# Altium schematic sheet Main IF Board 7.SchDoc: Up Converter DDR and 1st IF
size A3; Author: L Lerner; Revision: 0
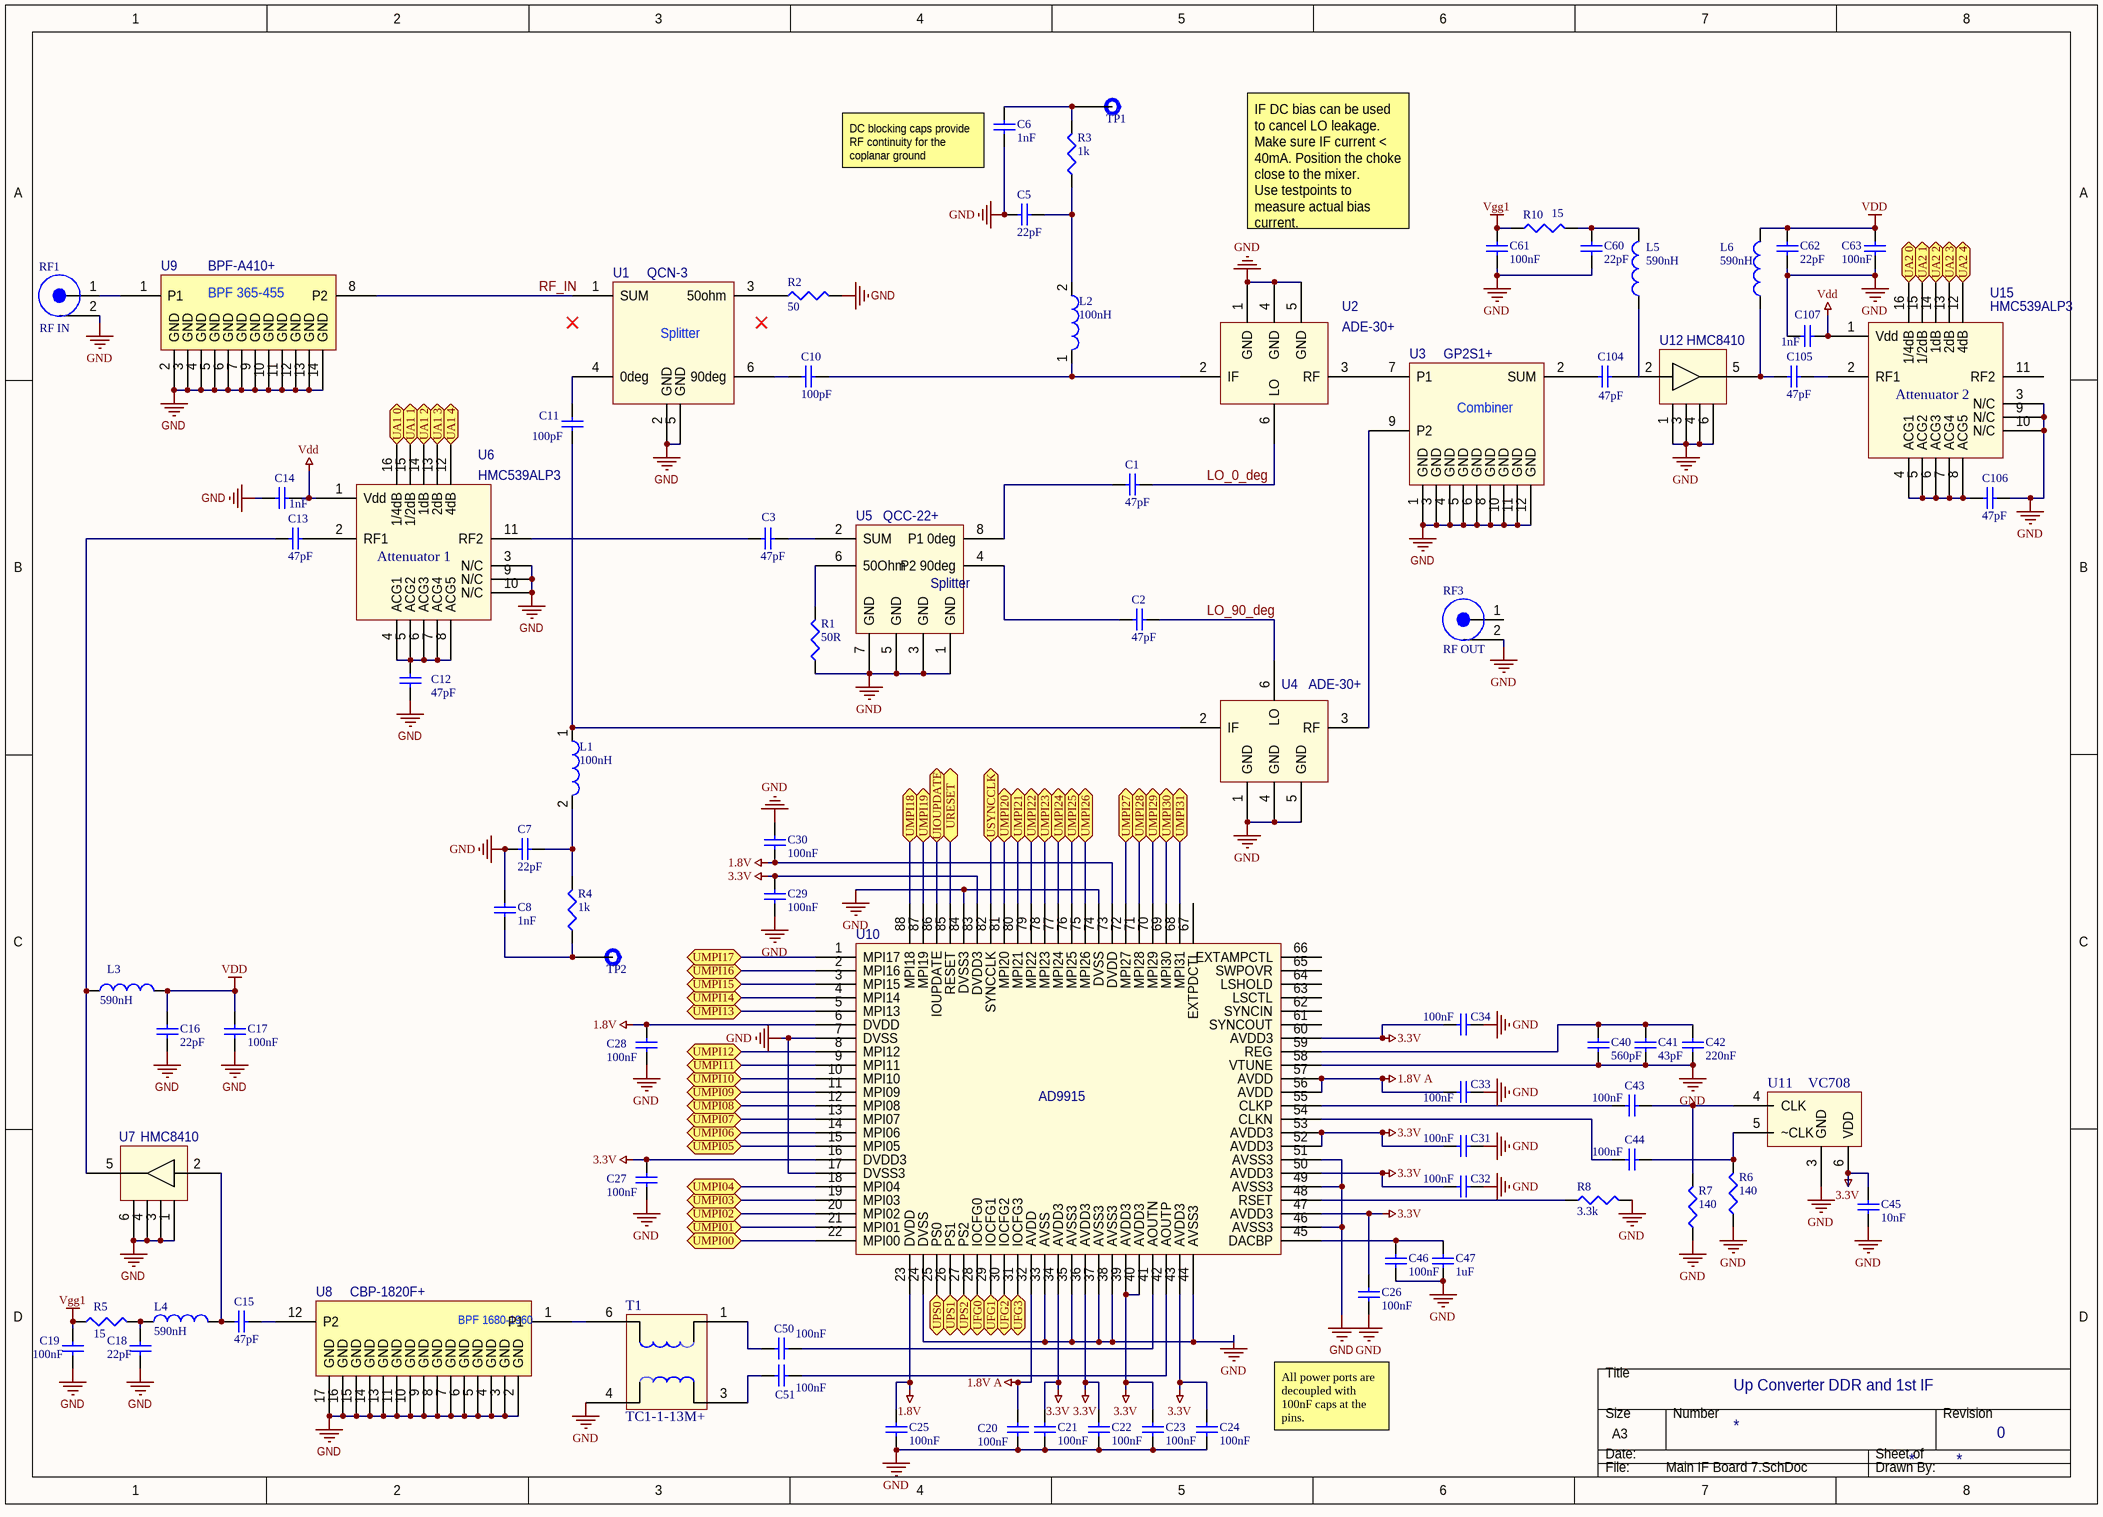
[diagram p0: Main IF Board 7.SchDoc]

## Parts
C1  value 47pF  [CAP0402]  (hidden comment: ATC520L103KT16T)
C2  value 47pF  [CAP0402]  (hidden comment: ATC520L103KT16T)
C3  value 47pF  [CAP0402]  (hidden comment: ATC520L103KT16T)
C5  value 22pF  [CAP0402]  (hidden comment: Capacitor)
C6  value 1nF  [CAP0603]  (hidden comment: Capacitor)
C7  value 22pF  [CAP0402]  (hidden comment: Capacitor)
C8  value 1nF  [CAP0603]  (hidden comment: Capacitor)
C10  value 100pF  [CAP0402]  (hidden comment: Capacitor)
C11  value 100pF  [CAP0402]  (hidden comment: Capacitor)
C12  value 47pF  [CAP0402]  (hidden comment: Capacitor)
C13  value 47pF  [CAP0402]  (hidden comment: Capacitor)
C14  value 1nF  [CAP0402]  (hidden comment: Capacitor)
C15  value 47pF  [CAP0402]  (hidden comment: Capacitor)
C16  value 22pF  [CAP0402]  (hidden comment: Capacitor)
C17  value 100nF  [CAP0402]  (hidden comment: Capacitor)
C18  value 22pF  [CAP0402]  (hidden comment: Capacitor)
C19  value 100nF  [CAP0603]  (hidden comment: Capacitor)
C20  value 100nF  [CAP0402]  (hidden comment: Capacitor)
C21  value 100nF  [CAP0402]  (hidden comment: Capacitor)
C22  value 100nF  [CAP0402]  (hidden comment: Capacitor)
C23  value 100nF  [CAP0402]  (hidden comment: Capacitor)
C24  value 100nF  [CAP0402]  (hidden comment: Capacitor)
C25  value 100nF  [CAP0402]  (hidden comment: Capacitor)
C26  value 100nF  [CAP0402]  (hidden comment: Capacitor)
C27  value 100nF  [CAP0402]  (hidden comment: Capacitor)
C28  value 100nF  [CAP0402]  (hidden comment: Capacitor)
C29  value 100nF  [CAP0402]  (hidden comment: Capacitor)
C30  value 100nF  [CAP0402]  (hidden comment: Capacitor)
C31  value 100nF  [CAP0402]  (hidden comment: Capacitor)
C32  value 100nF  [CAP0402]  (hidden comment: Capacitor)
C33  value 100nF  [CAP0402]  (hidden comment: Capacitor)
C34  value 100nF  [CAP0402]  (hidden comment: Capacitor)
C40  value 560pF  [CAP0402]  (hidden comment: Capacitor)
C41  value 43pF  [CAP0402]  (hidden comment: Capacitor)
C42  value 220nF  [CAP0603]  (hidden comment: Capacitor)
C43  value 100nF  [CAP0402]  (hidden comment: Capacitor)
C44  value 100nF  [CAP0402]  (hidden comment: Capacitor)
C45  value 10nF  [CAP0402]  (hidden comment: Capacitor)
C46  value 100nF  [CAP0402]  (hidden comment: Capacitor)
C47  value 1uF  [CAP0603]  (hidden comment: Capacitor)
C50  value 100nF  [CAP0402]  (hidden comment: Capacitor)
C51  value 100nF  [CAP0402]  (hidden comment: Capacitor)
C60  value 22pF  [CAP0402]  (hidden comment: Capacitor)
C61  value 100nF  [CAP0402]  (hidden comment: Capacitor)
C62  value 22pF  [CAP0402]  (hidden comment: Capacitor)
C63  value 100nF  [CAP0402]  (hidden comment: Capacitor)
C104  value 47pF  [CAP0402]  (hidden comment: ATC520L103KT16T)
C105  value 47pF  [CAP0402]  (hidden comment: Capacitor)
C106  value 47pF  [CAP0402]  (hidden comment: Capacitor)
C107  value 1nF  [CAP0402]  (hidden comment: Capacitor)
L1  value 100nH  [Coilcraft_BCL-122]  (hidden comment: Inductor)
L2  value 100nH  [Coilcraft_BCL-122]  (hidden comment: Inductor)
L3  value 590nH  [CAP0402]  (hidden comment: Inductor)
L4  value 590nH  [CAP0402]  (hidden comment: Inductor)
L5  value 590nH  [CAP0402]  (hidden comment: Inductor)
L6  value 590nH  [TBD]  (hidden comment: Inductor)
R1  value 50R  [RES0603]  (hidden comment: Resistor)
R2  value 50  [RES0603]  (hidden comment: Resistor)
R3  value 1k  [RES0603]  (hidden comment: Resistor)
R4  value 1k  [RES0603]  (hidden comment: Resistor)
R5  value 15  [RES0402]  (hidden comment: Resistor)
R6  value 140  [RES0402]  (hidden comment: Resistor)
R7  value 140  [RES0402]  (hidden comment: Resistor)
R8  value 3.3k  [RES0402]  (hidden comment: Resistor)
R10  value 15  [RES0402]  (hidden comment: Resistor)
RF1  RF IN  [SMA_edge_launch_cutout_Cinch]
RF3  RF OUT  [SMA_edge_launch_cutout_Cinch]
T1  TC1-1-13M+
TP1  TP1  [1XHeader 100mil]  (value not drawn)
TP2  TP2  [1XHeader 100mil]  (value not drawn)
U1  QCN-3  [FV1206-1]
U2  ADE-30+  [Minicircuits_CD542]
U3  GP2S1+  [DQ1225]
U4  ADE-30+  [Minicircuits_CD542]
U5  QCC-22+  [Minicircuits_GF981]
U6  HMC539ALP3
U7  HMC8410
U8  CBP-1820F+  [CBP-1820F+]
U9  BPF-A410+  [BPF-A410+]
U10  AD9915  [AD9915]
U11  VC708  [VC708]
U12  HMC8410  [HMC8410]
U15  HMC539ALP3  [HMC539ALP3]

## Ports
UA1 0 (bidir), UA1 1 (bidir), UA1 2 (bidir), UA1 3 (bidir), UA1 4 (bidir), UA2 0 (bidir), UA2 1 (bidir), UA2 2 (bidir), UA2 3 (bidir), UA2 4 (bidir), UFG0 (bidir), UFG1 (bidir), UFG2 (bidir), UFG3 (bidir), UIOUPDATE (bidir), UMPI00 (bidir), UMPI01 (bidir), UMPI02 (bidir), UMPI03 (bidir), UMPI04 (bidir), UMPI05 (bidir), UMPI06 (bidir), UMPI07 (bidir), UMPI08 (bidir), UMPI09 (bidir), UMPI10 (bidir), UMPI11 (bidir), UMPI12 (bidir), UMPI13 (bidir), UMPI14 (bidir), UMPI15 (bidir), UMPI16 (bidir), UMPI17 (bidir), UMPI18 (bidir), UMPI19 (bidir), UMPI20 (bidir), UMPI21 (bidir), UMPI22 (bidir), UMPI23 (bidir), UMPI24 (bidir), UMPI25 (bidir), UMPI26 (bidir), UMPI27 (bidir), UMPI28 (bidir), UMPI29 (bidir), UMPI30 (bidir), UMPI31 (bidir), UPS0 (bidir), UPS1 (bidir), UPS2 (bidir), URESET (bidir), USYNCCLK (bidir)

## Nets
1.8V: C25.2 C28.2 C30.1 U10.6(DVDD) U10.23(DVDD) U10.73(DVDD)
1.8V A: C20.2 C33.1 U10.32(AVDD) U10.56(AVDD) U10.57(AVDD)
3.3V: C21.2 C22.2 C23.2 C24.2 C26.2 C27.1 C29.2 C31.1 C32.1 C34.1 C45.2 U10.16(DVDD3) U10.34(AVDD3) U10.36(AVDD3) U10.39(AVDD3) U10.40(AVDD3) U10.43(AVDD3) U10.47(AVDD3) U10.50(AVDD3) U10.52(AVDD3) U10.53(AVDD3) U10.60(AVDD3) U10.83(DVDD3) U11.6(VDD)
GND: C5.1 C6.2 C7.1 C8.2 C12.1 C14.1 C16.1 C17.1 C18.1 C19.1 C20.1 C21.1 C22.1 C23.1 C24.1 C25.1 C26.1 C27.2 C28.1 C29.1 C30.2 C31.2 C32.2 C33.2 C34.2 C40.1 C41.1 C42.1 C45.1 C46.1 C47.1 C60.1 C61.1 C62.1 C63.1 C106.2 C107.1 R1.1 R2.2 R6.1 R7.1 R8.2 RF1.2 RF3.2 T1.4 U1.2(GND) U1.5(GND) U2.1(GND) U2.4(GND) U2.5(GND) U3.1(GND) U3.3(GND) U3.4(GND) U3.5(GND) U3.6(GND) U3.8(GND) U3.10(GND) U3.11(GND) U3.12(GND) U4.1(GND) U4.4(GND) U4.5(GND) U5.1(GND) U5.3(GND) U5.5(GND) U5.7(GND) U6.3(N/C) U6.9(N/C) U6.10(N/C) U7.1 U7.3 U7.4 U7.6 U8.2(GND) U8.3(GND) U8.4(GND) U8.5(GND) U8.6(GND) U8.7(GND) U8.8(GND) U8.9(GND) U8.10(GND) U8.11(GND) U8.13(GND) U8.14(GND) U8.15(GND) U8.16(GND) U8.17(GND) U9.2(GND) U9.3(GND) U9.4(GND) U9.5(GND) U9.6(GND) U9.7(GND) U9.9(GND) U9.10(GND) U9.11(GND) U9.12(GND) U9.13(GND) U9.14(GND) U10.7(DVSS) U10.17(DVSS3) U10.24(DVSS) U10.33(AVSS) U10.35(AVSS3) U10.37(AVSS3) U10.38(AVSS3) U10.44(AVSS3) U10.46(AVSS3) U10.49(AVSS3) U10.51(AVSS3) U10.58(VTUNE) U10.74(DVSS) U10.84(DVSS3) U11.3(GND) U12.1 U12.3 U12.4 U12.6 U15.3(N/C) U15.9(N/C) U15.10(N/C)
VDD: C14.2 C16.2 C17.2 C62.2 C63.2 C107.2 L3.2 L6.2 U6.1(Vdd) U15.1(Vdd)
Vgg1: C19.2 C61.2 R5.1 R10.1
LO_0_deg: C1.1 U2.6(LO)
LO_90_deg: C2.2 U4.6(LO)
RF_IN: U1.1(SUM) U9.8(P2)
UA1 0: U6.16(1/4dB) ; port UA1 0
UA1 1: U6.15(1/2dB) ; port UA1 1
UA1 2: U6.14(1dB) ; port UA1 2
UA1 3: U6.13(2dB) ; port UA1 3
UA1 4: U6.12(4dB) ; port UA1 4
UA2 0: U15.16(1/4dB) ; port UA2 0
UA2 1: U15.15(1/2dB) ; port UA2 1
UA2 2: U15.14(1dB) ; port UA2 2
UA2 3: U15.13(2dB) ; port UA2 3
UA2 4: U15.12(4dB) ; port UA2 4
UFG0: U10.28(IOCFG0) ; port UFG0
UFG1: U10.29(IOCFG1) ; port UFG1
UFG2: U10.30(IOCFG2) ; port UFG2
UFG3: U10.31(IOCFG3) ; port UFG3
UIOUPDATE: U10.86(IOUPDATE) ; port UIOUPDATE
UMPI00: U10.22(MPI00) ; port UMPI00
UMPI01: U10.21(MPI01) ; port UMPI01
UMPI02: U10.20(MPI02) ; port UMPI02
UMPI03: U10.19(MPI03) ; port UMPI03
UMPI04: U10.18(MPI04) ; port UMPI04
UMPI05: U10.15(MPI05) ; port UMPI05
UMPI06: U10.14(MPI06) ; port UMPI06
UMPI07: U10.13(MPI07) ; port UMPI07
UMPI08: U10.12(MPI08) ; port UMPI08
UMPI09: U10.11(MPI09) ; port UMPI09
UMPI10: U10.10(MPI10) ; port UMPI10
UMPI11: U10.9(MPI11) ; port UMPI11
UMPI12: U10.8(MPI12) ; port UMPI12
UMPI13: U10.5(MPI13) ; port UMPI13
UMPI14: U10.4(MPI14) ; port UMPI14
UMPI15: U10.3(MPI15) ; port UMPI15
UMPI16: U10.2(MPI16) ; port UMPI16
UMPI17: U10.1(MPI17) ; port UMPI17
UMPI18: U10.88(MPI18) ; port UMPI18
UMPI19: U10.87(MPI19) ; port UMPI19
UMPI20: U10.81(MPI20) ; port UMPI20
UMPI21: U10.80(MPI21) ; port UMPI21
UMPI22: U10.79(MPI22) ; port UMPI22
UMPI23: U10.78(MPI23) ; port UMPI23
UMPI24: U10.77(MPI24) ; port UMPI24
UMPI25: U10.76(MPI25) ; port UMPI25
UMPI26: U10.75(MPI26) ; port UMPI26
UMPI27: U10.72(MPI27) ; port UMPI27
UMPI28: U10.71(MPI28) ; port UMPI28
UMPI29: U10.70(MPI29) ; port UMPI29
UMPI30: U10.69(MPI30) ; port UMPI30
UMPI31: U10.68(MPI31) ; port UMPI31
UPS0: U10.25(PS0) ; port UPS0
UPS1: U10.26(PS1) ; port UPS1
UPS2: U10.27(PS2) ; port UPS2
URESET: U10.85(RESET) ; port URESET
USYNCCLK: U10.82(SYNCCLK) ; port USYNCCLK
NetC1_2: C1.2 U5.8(P1_0deg)
NetC2_1: C2.1 U5.4(P2_90deg)
NetC3_1: C3.1 U6.11(RF2)
NetC3_2: C3.2 U5.2(SUM)
NetC5_2: C5.2 L2.2 R3.2
NetC6_1: C6.1 R3.1 TP1.1
NetC7_2: C7.2 L1.2 R4.2
NetC8_1: C8.1 R4.1 TP2.1
NetC10_1: C10.1 U1.6(90deg)
NetC10_2: C10.2 L2.1 U2.2(IF)
NetC11_1: C11.1 U1.4(0deg)
NetC11_2: C11.2 L1.1 U4.2(IF)
NetC12_2: C12.2 U6.4(ACG1) U6.5(ACG2) U6.6(ACG3) U6.7(ACG4) U6.8(ACG5)
NetC13_1: C13.1 L3.1 U7.5
NetC13_2: C13.2 U6.2(RF1)
NetC15_1: C15.1 L4.2 U7.2
NetC15_2: C15.2 U8.12(P2)
NetC18_2: C18.2 L4.1 R5.2
NetC40_2: C40.2 C41.2 C42.2 U10.59(REG)
NetC43_1: C43.1 U10.55(CLKP)
NetC43_2: C43.2 R7.2 U11.4(CLK)
NetC44_1: C44.1 U10.54(CLKN)
NetC44_2: C44.2 R6.2 U11.5(~CLK)
NetC46_2: C46.2 C47.2 U10.45(DACBP)
NetC50_1: C50.1 T1.1
NetC50_2: C50.2 U10.41(AOUTN)
NetC51_1: C51.1 T1.3
NetC51_2: C51.2 U10.42(AOUTP)
NetC60_2: C60.2 L5.2 R10.2
NetC104_1: C104.1 U12.2
NetC104_2: C104.2 U3.2(SUM)
NetC105_1: C105.1 L6.1 U12.5
NetC105_2: C105.2 U15.2(RF1)
NetC106_1: C106.1 U15.4(ACG1) U15.5(ACG2) U15.6(ACG3) U15.7(ACG4) U15.8(ACG5)
NetR1_2: R1.2 U5.6(50Ohm)
NetR2_1: R2.1 U1.3(50ohm)
NetR8_1: R8.1 U10.48(RSET)
NetRF1_1: RF1.1 U9.1(P1)
NetT1_6: T1.6 U8.1(P1)
NetU2_3: U2.3(RF) U3.7(P1)
NetU3_9: U3.9(P2) U4.3(RF)

Not connected (* = marked no-connect by the designer): L5 1; RF3 1; U10 61(SYNCOUT) 62(SYNCIN) 63(LSCTL) 64(LSHOLD) 65(SWPOVR) 66(EXTAMPCTL) 67(EXTPDCTL); U15 11(RF2)

## Notes on the sheet
- (near C6) DC blocking caps provide RF continuity for the coplanar ground
- IF DC bias can be used to cancel LO leakage. Make sure IF current < 40mA. Position the choke close to the mixer.
  Use testpoints to measure actual bias current.
- (near U15) Attenuator 2
- (near U6) Attenuator 1
- All power ports are decoupled with 100nF caps at the pins.
- (in symbol BPF-A410+) BPF 365-455
- (in symbol CBP-1820F+) BPF 1680-1960
- (in symbol GP2S1+) Combiner
- (in symbol minicircuits_QCC-22+) Splitter
- (in symbol QCN-3) Splitter

## Library data of the parts
C1-C3 C104 = Capacitor
L3 L4 = Inductor: Model: 0402DF-591XJRU
RF1 RF3 = RF_connector: RF connector w/  pin and barrel
T1 = Trans: Published: 24-Mar-1999; LatestRevisionDate: 08-Jul-2005; LatestRevisionNote: Mech Layer 1 removed.; PackageReference: TRANS; Publisher: Altium Limited; PackageDescription: Transformer; 4 Leads
TP1 TP2 = Test point
U2 U4 = minicircuits_ADE-30+: Minicircuits mixer ADE-30+, 200MHz-3000MHz
U5 = minicircuits_QCC-22+: Mini-Circuits_ power splitter/combiner QCC-22+, 1.5-2.5GHz
U11 = VC-708
C5-C8 C10-C34 C40-C47 C50 C51 C60-C63 C105-C107 = Capacitor
  C10-C34 C40-C47 C50 C51 C60-C63 C105-C107: Dielectric: *; Model: *; Voltage: *
L1 L2 L5 L6 = Inductor
  L5 L6: Model: *
R1-R8 R10 = Resistor
  R2-R8 R10: Type: *; Model: *